# EasyEDA schematic SCH_New-Project_2026-04-19 (1).json
TITLE: Sheet_1; REV: 1.0; Date: 2026-04-19; Sheet: 1/1; Drawn By: gaurabpandey828; Company: Your Company
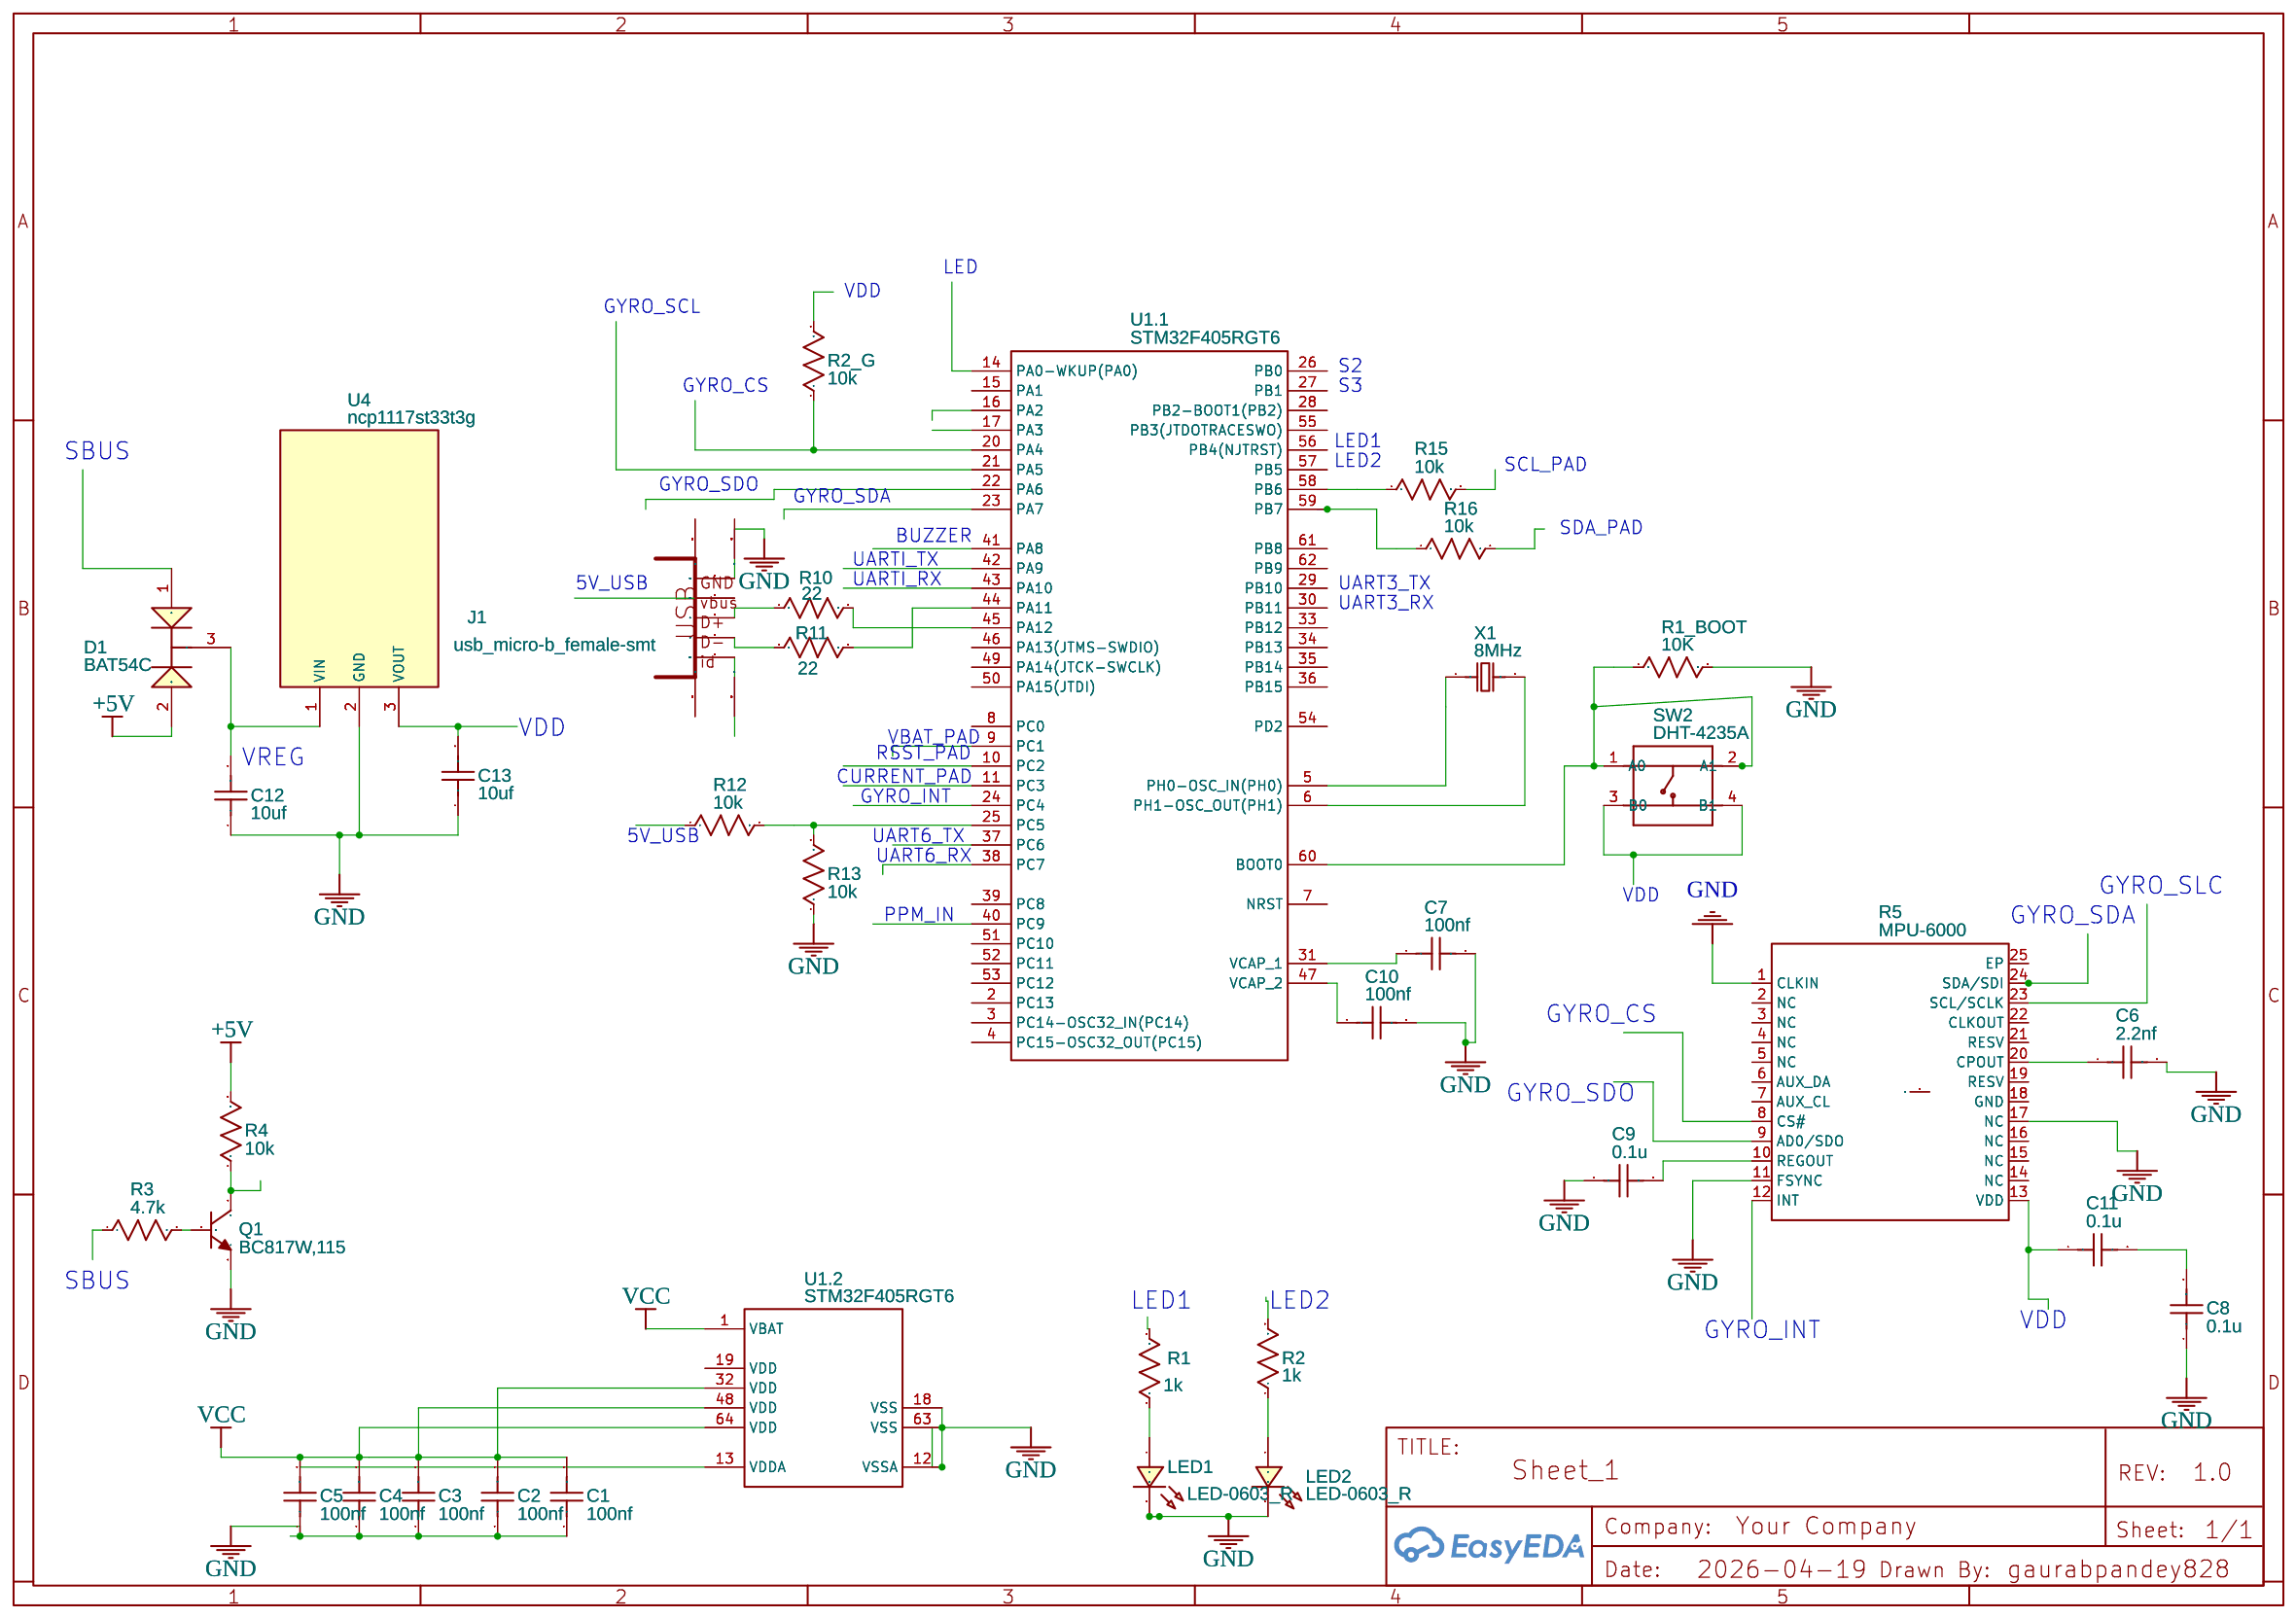
[diagram p0: schematic sheet]

## Parts
C1  100nf  [C0603]
C2  100nf  [C0603]
C3  100nf  [C0603]
C4  100nf  [C0603]
C5  100nf  [C0603]
C6  2.2nf  [C0603]
C7  100nf  [C0603]
C8  0.1u  [C0603]
C9  0.1u  [C0603]
C10  100nf  [C0603]
C11  0.1u  [C0603]
C12  10uf  [C0603]
C13  10uf  [C0603]
D1  BAT54C  [ONSC-SOT-323-3-419-04_V]
J1  usb_micro-b_female-smt  [CONN_USB_MICRO-B]
LED1  LED-0603_R  [LED0603_RED]
LED2  LED-0603_R  [LED0603_RED]
Q1  BC817W,115  [SOT-323-3_L2.0-W1.3-P1.30-LS2.1-BR]
R1  1k  [R0603]
R1_BOOT  10K  [R0603]
R2  1k  [R0603]
R2_G  10k  [R0603]
R3  4.7k  [R0603]
R4  10k  [R0603]
R5  MPU-6000  [QFN-24_L4.0-W4.0-P0.50-BL-EP2.7]
R10  22  [R0603]
R11  22  [R0603]
R12  10k  [R0603]
R13  10k  [R0603]
R15  10k  [R0603]
R16  10k  [R0603]
SW2  DHT-4235A  [SW4-SMD-4.2X3.2X2.5MM]
U1  STM32F405RGT6  [LQFP-64_L10.0-W10.0-P0.50-LS12.0-BL]  (sections 1,2)
U4  ncp1117st33t3g  [5V STEP-UP VOLTAGE REGULATOR NCP1402]
X1  8MHz  [CRYSTAL-SMD_L3.2-W2.5_3225-8MHZ]

## Library data of the parts
C1-C13 = C_0603_US: Contributor: LCEDA_Lib
D1 = BAT54CWT1: Dual Series Cathode Schottky Barrier Diodes, 3-Pin SOT-323, Tape and Reel
J1 = CON-USB-F-MICRO-B: USB Female connector; Contributor: DangerousPrototype
LED1 LED2 = LED-0603_R: Manufacturer: EVERLIGHT(台湾亿光); Manufacturer Part: 19-217/R6C-AL1M2VY/3T; Supplier Part: C72044; Supplier: LCSC; Contributor: LCEDA_01
Q1 = BC817W,115: Supplier: LCSC; Manufacturer: Nexperia(安世); Supplier Part: C75566; JLCPCB Part Class: Extended Part
R1 R1_BOOT R2 R2_G R3 R4 R10-R13 R15 R16 = R_0603_US: Contributor: LCEDA_Lib
R5 = MPU-6000: Contributor: LCSC; Supplier: LCSC; Supplier Part: C92401; Manufacturer: TDK InvenSense(应美盛); JLCPCB Part Class: Extended Part
SW2 = DHT-4235A: SMD Button Top
U1 = STM32F405RGT6: tags: STM32; subpart_no: 2; image: http://image.lceda.cn/szlcsc/C15742.jpg; Supplier Part: C15742; Supplier: LCSC; Manufacturer: ST(意法半导体); JLCPCB Part Class: Extended Part
U4 = 5V Step-Up Voltage Regulator NCP1402: Contributor: winter2015; sourceId: YsmgyP7pj
X1 = X22EL89COI-111YLC-8M: Supplier: LCSC; Supplier Part: C42448903; Manufacturer: YXC(扬兴晶振); Contributor: lcsc; JLCPCB Part Class: Extended Part

## Nets
+5V: D1.2(A2) R4.2
GND: C1.1 C2.1 C3.1 C4.1 C5.1 C6.2 C7.2 C8.1 C9.1 C10.2 C12.1 C13.1 J1.P5(GND) LED1.2 LED2.2 Q1.2(E) R1_BOOT.2 R5.1(CLKIN) R5.11(FSYNC) R5.17(NC) R13.1 U1.12(VSSA) U1.18(VSS) U1.63(VSS) U4.2(GND)
VCC: C1.2 C2.2 C3.2 C4.2 C5.2 U1.1(VBAT) U1.13(VDDA) U1.32(VDD) U1.48(VDD) U1.64(VDD)
Net-(C6-1): C6.1 R5.20(CPOUT)
Net-(C7-1): C7.1 U1.31(VCAP_1)
Net-(C8-2): C8.2 C11.2
Net-(C9-2): C9.2 R5.10(REGOUT)
Net-(C10-1): C10.1 U1.47(VCAP_2)
Net-(C11-1): C11.1 R5.13(VDD)
Net-(C12-2): C12.2 D1.3(K) U4.1(VIN)
Net-(C13-2): C13.2 U4.3(VOUT)
Net-(J1-P2): J1.P2(D-) R10.1
Net-(J1-P3): J1.P3(D+) R11.1
Net-(LED1-1): LED1.1 R1.1
Net-(LED2-1): LED2.1 R2.1
Net-(Q1-1): Q1.1(B) R3.2
Net-(Q1-3): Q1.3(C) R4.1
Net-(R1_BOOT-1): R1_BOOT.1 SW2.1(A0) SW2.2(A1) U1.60(BOOT0)
Net-(R2_G-1): R2_G.1 U1.20(PA4)
Net-(R10-2): R10.2 U1.45(PA12)
Net-(R11-2): R11.2 U1.44(PA11)
Net-(R12-2): R12.2 R13.2 U1.25(PC5)
Net-(R15-1): R15.1 U1.58(PB6)
Net-(R16-1): R16.1 U1.59(PB7)
Net-(SW2-3): SW2.3(B0) SW2.4(B1)
Net-(U1.1-5): U1.5(PH0-OSC_IN(PH0)) X1.1
Net-(U1.1-6): U1.6(PH1-OSC_OUT(PH1)) X1.2

Not connected (* = marked no-connect by the designer): D1 1(A1); J1 BODY@1(BODY) BODY@2(BODY) BODY@3(BODY) BODY@4(BODY) P1(VUSB) P4(USBID); R1 2; R2 2; R2_G 2; R3 1; R5 2(NC) 3(NC) 4(NC) 5(NC) 6(AUX_DA) 7(AUX_CL) 8(CS#) 9(AD0/SDO) 12(INT) 14(NC) 15(NC) 16(NC) 18(GND) 19(RESV) 21(RESV) 22(CLKOUT) 23(SCL/SCLK) 24(SDA/SDI) 25(EP); R12 1; R15 2; R16 2; U1 2(PC13) 3(PC14-OSC32_IN(PC14)) 4(PC15-OSC32_OUT(PC15)) 7(NRST) 8(PC0) 9(PC1) 10(PC2) 11(PC3) 14(PA0-WKUP(PA0)) 15(PA1) 16(PA2) 17(PA3) 19(VDD) 21(PA5) 22(PA6) 23(PA7) 24(PC4) 26(PB0) 27(PB1) 28(PB2-BOOT1(PB2)) 29(PB10) 30(PB11) 33(PB12) 34(PB13) 35(PB14) 36(PB15) 37(PC6) 38(PC7) 39(PC8) 40(PC9) 41(PA8) 42(PA9) 43(PA10) 46(PA13(JTMS-SWDIO)) 49(PA14(JTCK-SWCLK)) 50(PA15(JTDI)) 51(PC10) 52(PC11) 53(PC12) 54(PD2) 55(PB3(JTDOTRACESWO)) 56(PB4(NJTRST)) 57(PB5) 61(PB8) 62(PB9)

## Notes on the sheet
- LED
- GYRO_SCL
- VDD
- S2
- GYRO_CS
- S3
- SBUS
- LED1
- LED2
- SCL_PAD
- GYRO_SDO
- GYRO_SDA
- BUZZER
- SDA_PAD
- UARTI_TX
- 5V_USB
- UARTI_RX
- UART3_TX
- UART3_RX
- VDD
- VREG
- RSST_PAD
- VBAT_PAD
- CURRENT_PAD
- GYRO_INT
- 5V_USB
- UART6_TX
- UART6_RX
- VDD
- GYRO_SLC
- PPM_IN
- GYRO_SDA
- GYRO_CS
- GYRO_SDO
- SBUS
- LED1
- LED2
- GYRO_INT
- VDD
